# Altium project KC_Input_VAS_v0.2.PrjPcb
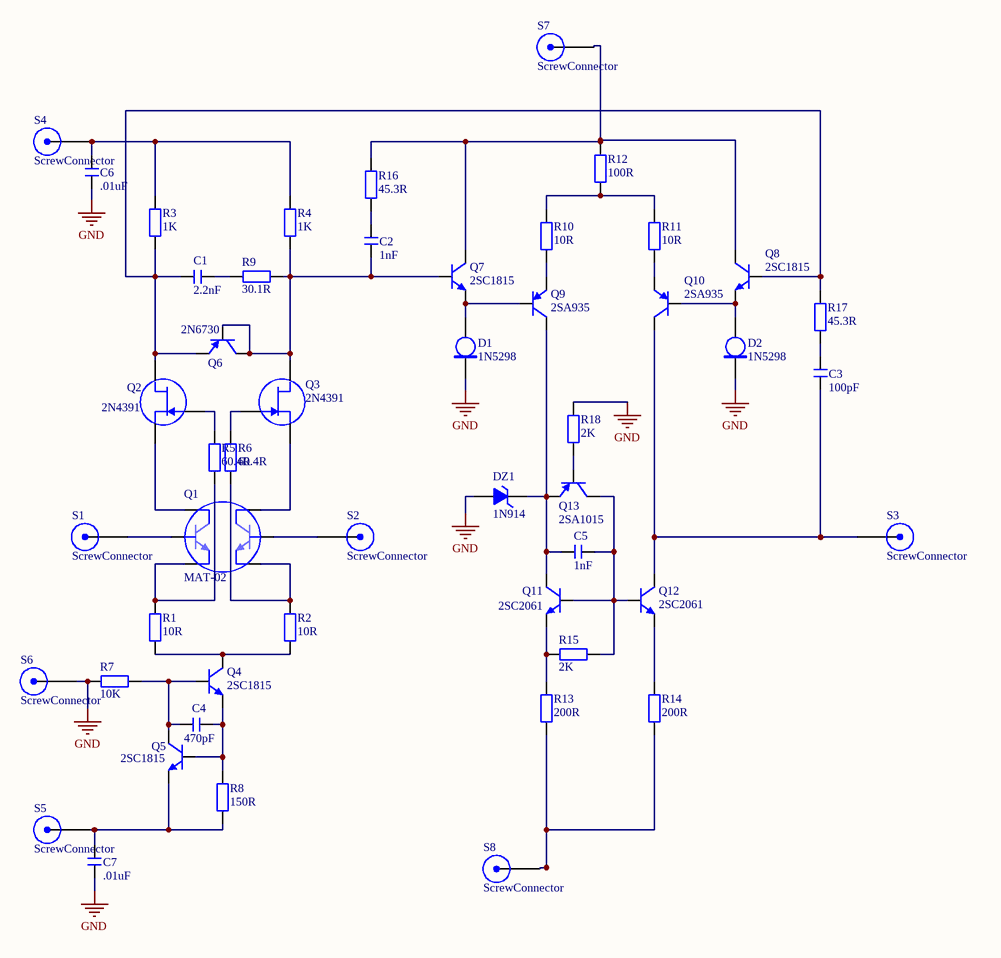
[diagram p0: KC_Input_VAS_Schematic_v0.2.SchDoc]
1 sheet, 49 parts. Net scope: global (net labels, ports and power ports of the same name join across sheets).
Board file: KC_Input_VAS_v0.2.PcbDoc

## Sheet KC_Input_VAS_Schematic_v0.2.SchDoc
size A4

### Parts
C1  2.2nF  [CBB 6.3*6.3*5]
C2  1nF  [CBB 6.3*6.3*5]
C3  100pF  [CBB 6.3*6.3*5]
C4  470pF  [CBB 6.3*6.3*5]
C5  1nF  [CBB 6.3*6.3*5]
C6  .01uF  [CBB 6.3*6.3*5]
C7  .01uF  [CBB 6.3*6.3*5]
D1  1N5298  [DO-41V]
D2  1N5298  [DO-41V]
DZ1  1N914  [DO-41]
Q1  MAT-02  [DIP-8]
Q2  2N4391  [TO-18_SMALLHOLE]
Q3  2N4391  [TO-18_SMALLHOLE]
Q4  2SC1815  [TO92A_SmallHole]
Q5  2SC1815  [TO92A_SmallHole]
Q6  2N6730  [TO92A_SmallHole]
Q7  2SC1815  [TO92A_SmallHole]
Q8  2SC1815  [TO92A_SmallHole]
Q9  2SA935  [TO92A_SmallHole]
Q10  2SA935  [TO92A_SmallHole]
Q11  2SC2061  [TO92A_SmallHole]
Q12  2SC2061  [TO92A_SmallHole]
Q13  2SA1015  [TO92A_SmallHole]
R1  10R  [RS 1/4W]
R2  10R  [RS 1/4W]
R3  1K  [RS 1/4W]
R4  1K  [RS 1/4W]
R5  60.4R  [RS 1/4W]
R6  60.4R  [RS 1/4W]
R7  10K  [RS 1/4W]
R8  150R  [RS 1/4W]
R9  30.1R  [RS 1/4W]
R10  10R  [RS 1/4W]
R11  10R  [RS 1/4W]
R12  100R  [RS 1/4W]
R13  200R  [RS 1/4W]
R14  200R  [RS 1/4W]
R15  2K  [RS 1/4W]
R16  45.3R  [RS 1/4W]
R17  45.3R  [RS 1/4W]
R18  2K  [RS 1/4W]
S1  ScrewConnector  [Screw-M3]
S2  ScrewConnector  [Screw-M3]
S3  ScrewConnector  [Screw-M3]
S4  ScrewConnector  [Screw-M3]
S5  ScrewConnector  [Screw-M3]
S6  ScrewConnector  [Screw-M3]
S7  ScrewConnector  [Screw-M3]
S8  ScrewConnector  [Screw-M3]

### Nets
GND: C6.2 C7.1 D1.1(Cathode) D2.1(Cathode) DZ1.1(A) R7.1 R18.2 S6.1(X)
NetC1_1: C1.1 Q2.3(D) Q6.1(E) Q8.3(B) R3.1 R17.2
NetC1_2: C1.2 R9.1
NetC2_1: C2.1 R16.1
NetC2_2: C2.2 Q3.3(D) Q6.2(C) Q6.3(B) Q7.3(B) R4.1 R9.2
NetC3_1: C3.1 Q10.2(C) Q12.2(C) S3.1(X)
NetC3_2: C3.2 R17.1
NetC4_1: C4.1 Q4.3(B) Q5.2(C) R7.2
NetC4_2: C4.2 Q4.1(E) Q5.3(B) R8.1
NetC5_1: C5.1 DZ1.2(K) Q9.2(C) Q11.2(C) Q13.1(E)
NetC5_2: C5.2 Q11.3(B) Q12.3(B) Q13.2(C) R15.1
NetC6_1: C6.1 R3.2 R4.2 S4.1(X)
NetC7_2: C7.2 Q5.1(E) R8.2 S5.1(X)
NetD1_2: D1.2(Anode) Q7.1(E) Q9.3(B)
NetD2_2: D2.2(Anode) Q8.1(E) Q10.3(B)
NetQ1_1: Q1.1(C) Q2.1(S)
NetQ1_2: Q1.2(B) S1.1(X)
NetQ1_3: Q1.3(E) R1.2 R5.1
NetQ1_5: Q1.5(E) R2.2 R6.1
NetQ1_6: Q1.6(B) S2.1(X)
NetQ1_7: Q1.7(C) Q3.1(S)
NetQ2_2: Q2.2(G) R5.2
NetQ3_2: Q3.2(G) R6.2
NetQ4_2: Q4.2(C) R1.1 R2.1
NetQ7_2: Q7.2(C) Q8.2(C) R12.2 R16.2 S7.1(X)
NetQ9_1: Q9.1(E) R10.1
NetQ10_1: Q10.1(E) R11.1
NetQ11_1: Q11.1(E) R13.2 R15.2
NetQ12_1: Q12.1(E) R14.2
NetQ13_3: Q13.3(B) R18.1
NetR10_2: R10.2 R11.2 R12.1
NetR13_1: R13.1 R14.1 S8.1(X)

### Library data of the parts
C1-C7 = C-CBB: CBB电容; 版权归属: 源创客; BOM名称: CBB电容; 学习资源: www.ooocke.com
D1 D2 = 1N5xxx: Current Regulator Diodes; pin to pad: 1>2 2>1
DZ1 = 1N4619: 3V/0.5W稳压管; 版权归属: 源创客; BOM名称: 3V/0.5W稳压管; 学习资源: www.ooocke.com
Q1 = MAT-02: 孪生对管-NPN型 40V/20ma; pin to pad: 5>6 6>7 7>8
Q2 Q3 = 2N4391: N沟道JFET开关管 40V/150ma; pin to pad: 2>3 3>2
Q4 Q5 Q7 Q8 = 2SC1815: 音频放大-NPN型
Q6 = 2N6728/6729/6730: 中功率放大-PNP型; pin to pad: 2>3 3>2
Q9 Q10 = 2SA935: 音频功放-PNP型 50V/500ma
Q11 Q12 = 2SC2061: 音频放大-NPN型 50V/500ma
Q13 = 2SA1015: 音频放大-PNP型
R1-R18 = R-CRR: 直插色环电阻; BOM名称: 色环电阻; 版权归属: 源创客; 学习资源: www.ooocke.com
S1-S8 = ScrewConnector: Screw Connector